# Altium project bme_affect.PrjPcb
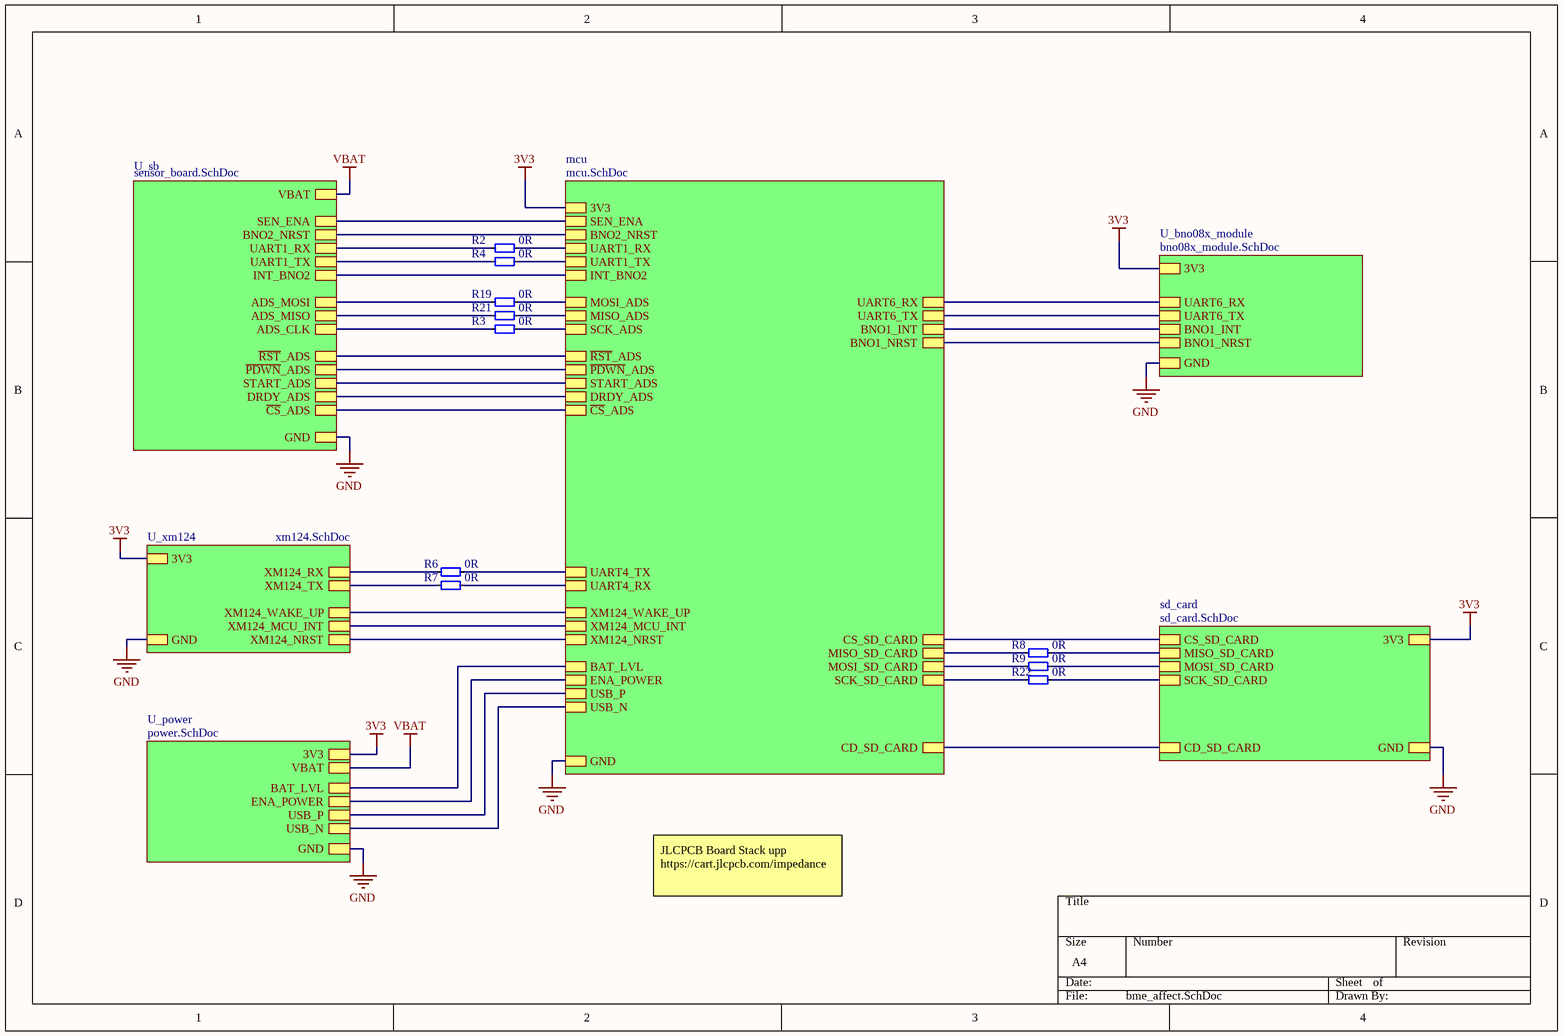
[diagram p0: bme_affect.SchDoc]
7 sheets, 138 parts. Net scope: strictly hierarchical (ports join the sheet entries above them; power ports are local).
Board file: bme_affect.PcbDoc
Sheets:
  bme_affect.SchDoc
    sd_card = sd_card.SchDoc
    mcu = mcu.SchDoc
    U_power = power.SchDoc
    U_xm124 = xm124.SchDoc
    U_sb = sensor_board.SchDoc
    U_bno08x_module = bno08x_module.SchDoc

## Sheet bme_affect.SchDoc
size A4; SheetNumber: 1; SheetTotal: 7

### Parts
R2  value 0R  [0402 res]  (hidden comment: 0603, resistor)
R3  value 0R  [0402 res]  (hidden comment: 0603, resistor)
R4  value 0R  [0402 res]  (hidden comment: 0603, resistor)
R6  value 0R  [0402 res]  (hidden comment: 0603, resistor)
R7  value 0R  [0402 res]  (hidden comment: 0603, resistor)
R8  value 0R  [0402 res]  (hidden comment: 0603, resistor)
R9  value 0R  [0402 res]  (hidden comment: 0603, resistor)
R19  value 0R  [0402 res]  (hidden comment: 0603, resistor)
R21  value 0R  [0402 res]  (hidden comment: 0603, resistor)
R22  value 0R  [0402 res]  (hidden comment: 0603, resistor)

### Sub-sheets
mcu = mcu.SchDoc: 3V3, GND, SCK_SD_CARD, MISO_SD_CARD, ~{CS}_ADS, MOSI_SD_CARD, CS_SD_CARD, ~{RST}_ADS, START_ADS, ~{PDWN}_ADS, CD_SD_CARD, USB_N, USB_P, MISO_ADS, DRDY_ADS, SCK_ADS, MOSI_ADS, UART6_RX, UART6_TX, INT_BNO2, UART1_RX, UART1_TX, BNO1_INT, BNO1_NRST, BNO2_NRST, XM124_NRST, XM124_MCU_INT, XM124_WAKE_UP, UART4_TX, UART4_RX, ENA_POWER, BAT_LVL, SEN_ENA
sd_card = sd_card.SchDoc: CS_SD_CARD, MISO_SD_CARD, MOSI_SD_CARD, SCK_SD_CARD, 3V3, GND, CD_SD_CARD
U_bno08x_module = bno08x_module.SchDoc: 3V3, GND, BNO1_INT, BNO1_NRST, UART6_RX, UART6_TX
U_power = power.SchDoc: GND, 3V3, VBAT, USB_N, USB_P, ENA_POWER, BAT_LVL
U_sb = sensor_board.SchDoc: ~{CS}_ADS, ADS_CLK, ADS_MISO, ADS_MOSI, DRDY_ADS, START_ADS, ~{RST}_ADS, ~{PDWN}_ADS, GND, VBAT, INT_BNO2, UART1_RX, UART1_TX, BNO2_NRST, SEN_ENA
U_xm124 = xm124.SchDoc: GND, 3V3, XM124_RX, XM124_TX, XM124_NRST, XM124_MCU_INT, XM124_WAKE_UP

### Nets
3V3: sheet sd_card/3V3, sheet mcu/3V3, sheet U_power/3V3, sheet U_xm124/3V3, sheet U_bno08x_module/3V3
GND: sheet sd_card/GND, sheet mcu/GND, sheet U_power/GND, sheet U_xm124/GND, sheet U_sb/GND, sheet U_bno08x_module/GND
VBAT: sheet U_power/VBAT, sheet U_sb/VBAT
BNO1_INT: sheet mcu/BNO1_INT, sheet U_bno08x_module/BNO1_INT
BNO1_NRST: sheet mcu/BNO1_NRST, sheet U_bno08x_module/BNO1_NRST
BNO2_NRST: sheet mcu/BNO2_NRST, sheet U_sb/BNO2_NRST
~{CS}_ADS: sheet mcu/~{CS}_ADS, sheet U_sb/~{CS}_ADS
CD_SD_CARD: sheet sd_card/CD_SD_CARD, sheet mcu/CD_SD_CARD
CS_SD_CARD: sheet sd_card/CS_SD_CARD, sheet mcu/CS_SD_CARD
DRDY_ADS: sheet mcu/DRDY_ADS, sheet U_sb/DRDY_ADS
INT_BNO2: sheet mcu/INT_BNO2, sheet U_sb/INT_BNO2
MISO_ADS: R21.0 ; sheet mcu/MISO_ADS
MISO_SD_CARD: R8.1 ; sheet mcu/MISO_SD_CARD
MOSI_ADS: R19.0 ; sheet mcu/MOSI_ADS
MOSI_SD_CARD: R9.1 ; sheet mcu/MOSI_SD_CARD
~{PDWN}_ADS: sheet mcu/~{PDWN}_ADS, sheet U_sb/~{PDWN}_ADS
~{RST}_ADS: sheet mcu/~{RST}_ADS, sheet U_sb/~{RST}_ADS
SCK_ADS: R3.0 ; sheet mcu/SCK_ADS
SCK_SD_CARD: R22.1 ; sheet mcu/SCK_SD_CARD
SEN_ENA: sheet mcu/SEN_ENA, sheet U_sb/SEN_ENA
START_ADS: sheet mcu/START_ADS, sheet U_sb/START_ADS
UART1_RX: R2.0 ; sheet mcu/UART1_RX
UART1_TX: R4.0 ; sheet mcu/UART1_TX
UART4_RX: R7.0 ; sheet mcu/UART4_RX
UART4_TX: R6.0 ; sheet mcu/UART4_TX
UART6_RX: sheet mcu/UART6_RX, sheet U_bno08x_module/UART6_RX
UART6_TX: sheet mcu/UART6_TX, sheet U_bno08x_module/UART6_TX
USB_N: sheet mcu/USB_N, sheet U_power/USB_N
USB_P: sheet mcu/USB_P, sheet U_power/USB_P
XM124_MCU_INT: sheet mcu/XM124_MCU_INT, sheet U_xm124/XM124_MCU_INT
XM124_NRST: sheet mcu/XM124_NRST, sheet U_xm124/XM124_NRST
XM124_WAKE_UP: sheet mcu/XM124_WAKE_UP, sheet U_xm124/XM124_WAKE_UP
NetD4_2: sheet mcu/ENA_POWER, sheet U_power/ENA_POWER
NetM1_2: R6.1 ; sheet U_xm124/XM124_RX
NetM1_3: R7.1 ; sheet U_xm124/XM124_TX
NetP1_3: R9.0 ; sheet sd_card/MOSI_SD_CARD
NetP1_5: R22.0 ; sheet sd_card/SCK_SD_CARD
NetP1_7: R8.0 ; sheet sd_card/MISO_SD_CARD
NetP2_4: R4.1 ; sheet U_sb/UART1_TX
NetP2_5: R2.1 ; sheet U_sb/UART1_RX
NetP2_7: R3.1 ; sheet U_sb/ADS_CLK
NetP2_8: R21.1 ; sheet U_sb/ADS_MISO
NetP2_9: R19.1 ; sheet U_sb/ADS_MOSI
NetR1_1: sheet mcu/BAT_LVL, sheet U_power/BAT_LVL

### Notes on the sheet
- JLCPCB Board Stack upp
  https://cart.jlcpcb.com/impedance

### Library data of the parts
R2-R4 R6-R9 R19 R21 R22 = 0603, resistor: Manufacturer Part No: RMCF0402ZT0R00

## Sheet sd_card.SchDoc
size A4; SheetNumber: 6; SheetTotal: 9
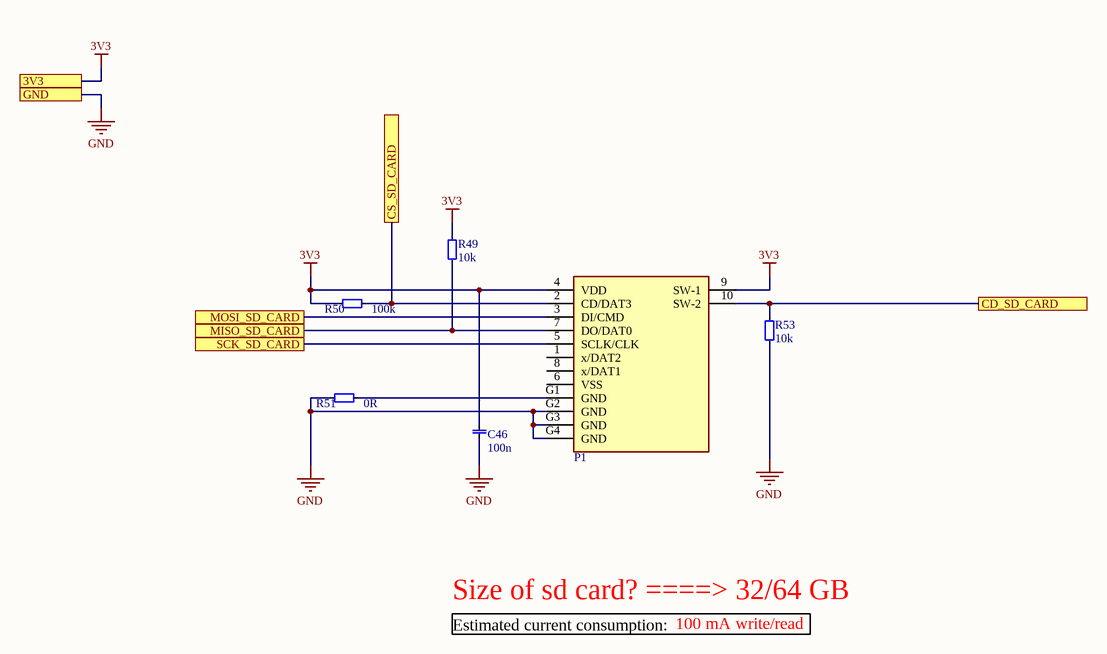
[diagram p1: sd_card.SchDoc]

### Parts
C46  value 100n  [0402 CAP]  (hidden comment: 0603, capacitor)
P1  SD Card connector  [MOLEX_104031-0811]  (value not drawn)
R49  value 10k  [0402 res]  (hidden comment: 0603, resistor)
R50  value 100k  [0402 res]  (hidden comment: 0603, resistor)
R51  value 0R  [0402 res]  (hidden comment: 0603, resistor)
R53  value 10k  [0402 res]  (hidden comment: 0603, resistor)

### Ports
3V3, CD_SD_CARD, CS_SD_CARD, GND, MISO_SD_CARD, MOSI_SD_CARD, SCK_SD_CARD

### Nets
3V3: C46.1 P1.4(VDD) P1.9(SW-1) R49.0 R50.0 ; port 3V3
GND: C46.0 P1.G2(GND) P1.G3(GND) P1.G4(GND) R51.0 R53.1 ; port GND
CD_SD_CARD: P1.10(SW-2) R53.0 ; port CD_SD_CARD
CS_SD_CARD: P1.2(CD/DAT3) R50.1 ; port CS_SD_CARD
NetP1_3: P1.3(DI/CMD) ; port MOSI_SD_CARD
NetP1_5: P1.5(SCLK/CLK) ; port SCK_SD_CARD
NetP1_7: P1.7(DO/DAT0) R49.1 ; port MISO_SD_CARD
NetP1_G1: P1.G1(GND) R51.1

Not connected (* = marked no-connect by the designer): P1 1(x/DAT2) 6(VSS) 8(x/DAT1)

### Notes on the sheet
- Size of sd card? ====> 32/64 GB
- Estimated current consumption:
- 100 mA write/read

### Library data of the parts
C46 = 0603, capacitor: Manufacturer Part No: GRM155R62A104KE14D; Order number: *
P1 = SD Card connector: SD Card connector - SD Card connector; Manufacturer Part No: 1040310811; Value: SD Card Connector
R49 R53 = 0603, resistor: Manufacturer Part No: 311-10.0KLRCT-ND
R50 = 0603, resistor: Manufacturer Part No: RC0402FR-07100KL
R51 = 0603, resistor: Manufacturer Part No: RMCF0402ZT0R00

## Sheet mcu.SchDoc
size A3; SheetNumber: 2; SheetTotal: 7
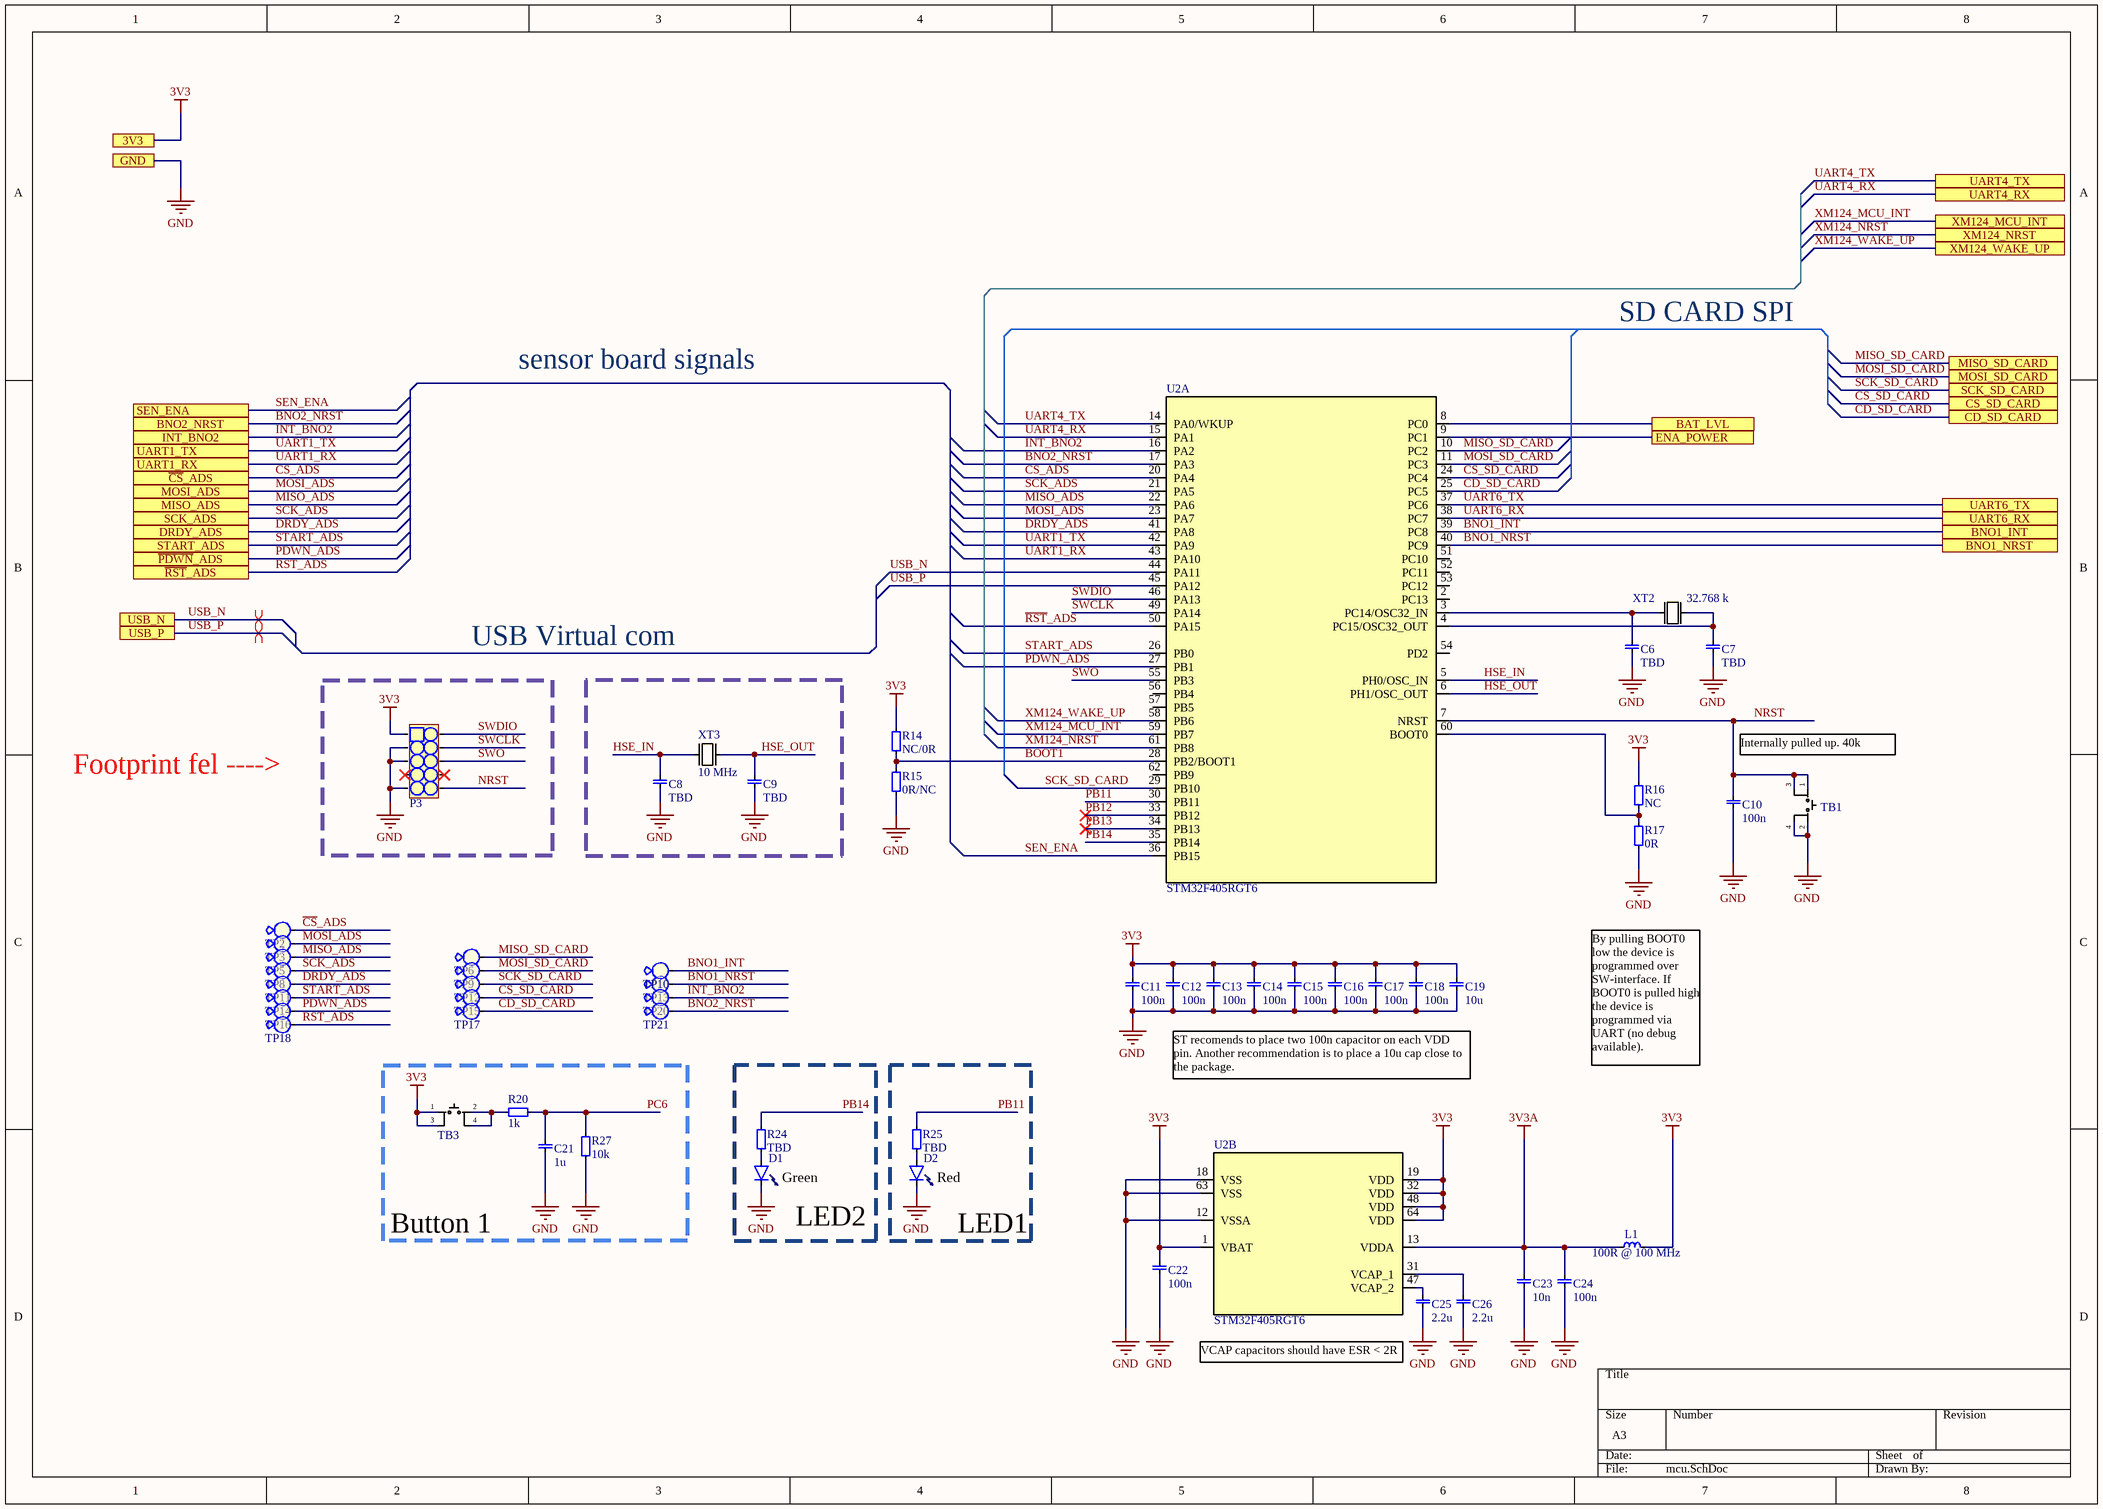
[diagram p2: mcu.SchDoc]

### Parts
C6  value TBD  [0603 cap]  (hidden comment: 0603, capacitor)
C7  value TBD  [0603 cap]  (hidden comment: 0603, capacitor)
C8  value TBD  [0603 cap]  (hidden comment: 0603, capacitor)
C9  value TBD  [0603 cap]  (hidden comment: 0603, capacitor)
C10  value 100n  [0402 CAP]  (hidden comment: 0603, capacitor)
C11  value 100n  [0402 CAP]  (hidden comment: 0603, capacitor)
C12  value 100n  [0402 CAP]  (hidden comment: 0603, capacitor)
C13  value 100n  [0402 CAP]  (hidden comment: 0603, capacitor)
C14  value 100n  [0402 CAP]  (hidden comment: 0603, capacitor)
C15  value 100n  [0402 CAP]  (hidden comment: 0603, capacitor)
C16  value 100n  [0402 CAP]  (hidden comment: 0603, capacitor)
C17  value 100n  [0402 CAP]  (hidden comment: 0603, capacitor)
C18  value 100n  [0402 CAP]  (hidden comment: 0603, capacitor)
C19  value 10u  [0402 CAP]  (hidden comment: 0603, capacitor)
C21  value 1u  [0402 CAP]  (hidden comment: 0603, capacitor)
C22  value 100n  [0402 CAP]  (hidden comment: 0603, capacitor)
C23  value 10n  [0402 CAP]  (hidden comment: 0603, capacitor)
C24  value 100n  [0402 CAP]  (hidden comment: 0603, capacitor)
C25  value 2.2u  [0402 CAP]  (hidden comment: 0603, capacitor)
C26  value 2.2u  [0402 CAP]  (hidden comment: 0603, capacitor)
D1  0603, LED  [0603 LED]  (value not drawn)
D2  0603, LED  [0603 LED]  (value not drawn)
L1  value 100R @ 100 MHz  [0805]  (hidden comment: 0805, Ferrite Bead)
P3  ARM 10 pin SWD  [FTSH-105-01-L-DV-K even odd]  (value not drawn)
R14  value NC/0R  [0402 res]  (hidden comment: 0603, resistor)
R15  value 0R/NC  [0402 res]  (hidden comment: 0603, resistor)
R16  value NC  [0402 res]  (hidden comment: 0603, resistor)
R17  value 0R  [0402 res]  (hidden comment: 0603, resistor)
R20  value 1k  [0402 res]  (hidden comment: 0603, resistor)
R24  value TBD  [0402 res]  (hidden comment: 0603, resistor)
R25  value TBD  [0402 res]  (hidden comment: 0603, resistor)
R27  value 10k  [0402 res]  (hidden comment: 0603, resistor)
TB1  Tactile Button  [tacButton smd]  (value not drawn)
TB3  Tactile Button  [tacButton smd]  (value not drawn)
TP2  Test Point  [testPoint]  (value not drawn)
TP3  Test Point  [testPoint]  (value not drawn)
TP5  Test Point  [testPoint]  (value not drawn)
TP6  Test Point  [testPoint]  (value not drawn)
TP8  Test Point  [testPoint]  (value not drawn)
TP9  Test Point  [testPoint]  (value not drawn)
TP10  Test Point  [testPoint]  (value not drawn)
TP11  Test Point  [testPoint]  (value not drawn)
TP12  Test Point  [testPoint]  (value not drawn)
TP13  Test Point  [testPoint]  (value not drawn)
TP14  Test Point  [testPoint]  (value not drawn)
TP15  Test Point  [testPoint]  (value not drawn)
TP16  Test Point  [testPoint]  (value not drawn)
TP17  Test Point  [testPoint]  (value not drawn)
TP18  Test Point  [testPoint]  (value not drawn)
TP20  Test Point  [testPoint]  (value not drawn)
TP21  Test Point  [testPoint]  (value not drawn)
U2  STM32F405RGT6  [LQFP64-10x10mm_s]  (parts A,B of 2)
XT2  value 32.768 k  [ECS-.327-12.5-39-TR]  (hidden comment: Crystal)
XT3  value 10 MHz  [XTAL_SMD_LP]  (hidden comment: XTAL TXC 7A)

### Blocks framed on the sheet
Button 1: C21 R20 R27 TB3
LED2: D1 R24
LED1: D2 R25

### Ports
3V3, BAT_LVL, BNO1_INT, BNO1_NRST, BNO2_NRST, CD_SD_CARD, CS_SD_CARD, DRDY_ADS, ENA_POWER, GND, INT_BNO2, MISO_ADS, MISO_SD_CARD, MOSI_ADS, MOSI_SD_CARD, SCK_ADS, SCK_SD_CARD, SEN_ENA, START_ADS, UART1_RX, UART1_TX, UART4_RX, UART4_TX, UART6_RX, UART6_TX, USB_N, USB_P, XM124_MCU_INT, XM124_NRST, XM124_WAKE_UP, ~{CS}_ADS, ~{PDWN}_ADS, ~{RST}_ADS

### Nets
3V3: C11.1 C12.1 C13.1 C14.1 C15.1 C16.1 C17.1 C18.1 C19.1 C22.1 L1.0 P3.1 R14.0 R16.0 TB3.1 TB3.3 U2.1(VBAT) U2.19(VDD) U2.32(VDD) U2.48(VDD) U2.64(VDD) ; port 3V3
3V3A: C23.1 C24.1 L1.1 U2.13(VDDA)
GND: C6.0 C7.0 C8.0 C9.0 C10.0 C11.0 C12.0 C13.0 C14.0 C15.0 C16.0 C17.0 C18.0 C19.0 C21.0 C22.0 C23.0 C24.0 C25.0 C26.0 D1.0(Cathode) D2.0(Cathode) P3.3 P3.5 P3.9 R15.1 R17.1 R27.0 TB1.2 TB1.4 U2.12(VSSA) U2.18(VSS) U2.63(VSS) ; port GND
BNO1_INT: TP10.0 U2.39(PC8) ; port BNO1_INT
BNO1_NRST: TP13.0 U2.40(PC9) ; port BNO1_NRST
BNO2_NRST: TP21.0 U2.17(PA3) ; port BNO2_NRST
BOOT1: R14.1 R15.0 U2.28(PB2/BOOT1)
~{CS}_ADS: TP2.0 U2.20(PA4) ; port ~{CS}_ADS
CD_SD_CARD: TP17.0 U2.25(PC5) ; port CD_SD_CARD
CS_SD_CARD: TP15.0 U2.24(PC4) ; port CS_SD_CARD
DRDY_ADS: TP11.0 U2.41(PA8) ; port DRDY_ADS
HSE_IN: C8.1 U2.5(PH0/OSC_IN) XT3.1
HSE_OUT: C9.1 U2.6(PH1/OSC_OUT) XT3.2
INT_BNO2: TP20.0 U2.16(PA2) ; port INT_BNO2
MISO_ADS: TP5.0 U2.22(PA6) ; port MISO_ADS
MISO_SD_CARD: TP6.0 U2.10(PC2) ; port MISO_SD_CARD
MOSI_ADS: TP3.0 U2.23(PA7) ; port MOSI_ADS
MOSI_SD_CARD: TP9.0 U2.11(PC3) ; port MOSI_SD_CARD
NRST: C10.1 P3.10 TB1.1 TB1.3 U2.7(NRST)
~{PDWN}_ADS: TP16.0 U2.27(PB1) ; port ~{PDWN}_ADS
PB11: R25.1 U2.30(PB11)
PB12: U2.33(PB12)
PB13: U2.34(PB13)
PB14: R24.1 U2.35(PB14)
PC6: C21.1 R20.1 R27.1
~{RST}_ADS: TP18.0 U2.50(PA15) ; port ~{RST}_ADS
SCK_ADS: TP8.0 U2.21(PA5) ; port SCK_ADS
SCK_SD_CARD: TP12.0 U2.29(PB10) ; port SCK_SD_CARD
SEN_ENA: U2.36(PB15) ; port SEN_ENA
START_ADS: TP14.0 U2.26(PB0) ; port START_ADS
SWCLK: P3.4 U2.49(PA14)
SWDIO: P3.2 U2.46(PA13)
SWO: P3.6 U2.55(PB3)
UART1_RX: U2.43(PA10) ; port UART1_RX
UART1_TX: U2.42(PA9) ; port UART1_TX
UART4_RX: U2.15(PA1) ; port UART4_RX
UART4_TX: U2.14(PA0/WKUP) ; port UART4_TX
UART6_RX: U2.38(PC7) ; port UART6_RX
UART6_TX: U2.37(PC6) ; port UART6_TX
USB_N: U2.44(PA11) ; port USB_N
USB_P: U2.45(PA12) ; port USB_P
XM124_MCU_INT: U2.59(PB7) ; port XM124_MCU_INT
XM124_NRST: U2.61(PB8) ; port XM124_NRST
XM124_WAKE_UP: U2.58(PB6) ; port XM124_WAKE_UP
NetC6_1: C6.1 U2.3(PC14/OSC32_IN) XT2.1
NetC7_1: C7.1 U2.4(PC15/OSC32_OUT) XT2.2
NetC25_1: C25.1 U2.47(VCAP_2)
NetC26_1: C26.1 U2.31(VCAP_1)
NetD1_1: D1.1 R24.0
NetD2_1: D2.1 R25.0
NetD4_2: U2.9(PC1) ; port ENA_POWER
NetR1_1: U2.8(PC0) ; port BAT_LVL
NetR16_1: R16.1 R17.0 U2.60(BOOT0)
NetR20_0: R20.0 TB3.2 TB3.4

Not connected (* = marked no-connect by the designer): P3 7* 8*; U2 2(PC13) 51(PC10) 52(PC11) 53(PC12) 54(PD2) 56(PB4) 57(PB5) 62(PB9)

### Layout directives
differential pair: USB_N, USB_P

### Notes on the sheet
- sensor board signals
- SD CARD SPI
- USB Virtual com
- Footprint fel ---->
- Internally pulled up. 40k
- ST recomends to place two 100n capacitor on each VDD pin. Another recommendation is to place a 10u cap close to the package.
- By pulling BOOT0 low the device is programmed over SW-interface. If BOOT0 is pulled high the device is programmed via UART (no debug available).
- Green
- Red
- VCAP capacitors should have ESR < 2R

### Library data of the parts
C10-C18 C22 C24 = 0603, capacitor: Manufacturer Part No: GRM155R62A104KE14D; Order number: *
C19 = 0603, capacitor: Manufacturer Part No: GRM155R61A106ME11D; Order number: *
C21 = 0603, capacitor: Manufacturer Part No: C0402C105K9PAC7867; Order number: *
C23 = 0603, capacitor: Manufacturer Part No: CC0402KRX7R0BB103; Order number: *
C25 C26 = 0603, capacitor: Manufacturer Part No: GRM155D71A225ME15D; Order number: *
D1 = 0603, LED: Manufacturer Part No: 5988081107F
D2 = 0603, LED: Manufacturer Part No: 150060SS75003
L1 = 0805, Ferrite Bead: Manufacturer Part No: 74279207; Order number: 732-4624-1-ND; Supplier: Digikey
P3 = ARM 10 pin SWD: 1.27mm, PH; Manufacturer Part No: FTSH-105-01-L-DV-K; Value: 2x5 Pin Header, 2.54mm, Th; Digikey: FTSH-105-01-L-DV-K
R14 R15 R17 = 0603, resistor: Manufacturer Part No: RMCF0402ZT0R00
R20 = 0603, resistor: Manufacturer Part No: RC0402FR-071KL
R27 = 0603, resistor: Manufacturer Part No: 311-10.0KLRCT-ND
TB1 TB3 = TacButton SMD: Tactile Switch Small Low; Manufacturer Part No: 430182043816; ELFA: 110-87-406; Value: Button SMD
U2 = STM32F405RGT6: No Description Available; Vendor: STMicroelectronics; Built_By: EMA_UL_Team; SourceLibrary: Updates_to_database_2020-10-19; Manufacturer Part Number: STM32F405RGT6; Copyright: Copyright (C) 2018 Accelerated Designs. All rights reserved; RefDes: RefDes; Type: DEV; Manufacturer Part No: STM32F405RGT6
XT2 = Crystal: Manufacturer Part No: CC4V-T1A-32.768KHZ-9PF-20PPM-TA-QC; Order number: 2195-CC4V-T1A-32.768KHZ-9PF-20PPM-TA-QCCT-ND; Supplier: Digikey
XT3 = XTAL TXC 7A: 16 MHz, SMD, 5mm x 3,2mm, 30 ppm; Manufacturer Part No: 7A-10.000MAAJ-T; Order number: 1841939; Supplier: Farnell
C6-C9 = 0603, capacitor: Order number: *
TP2 TP3 TP5 TP6 TP8-TP18 TP20 TP21 = Test Point: Value: Test point; Farnell: 1702006

## Sheet power.SchDoc
size A4; SheetNumber: 3; SheetTotal: 7
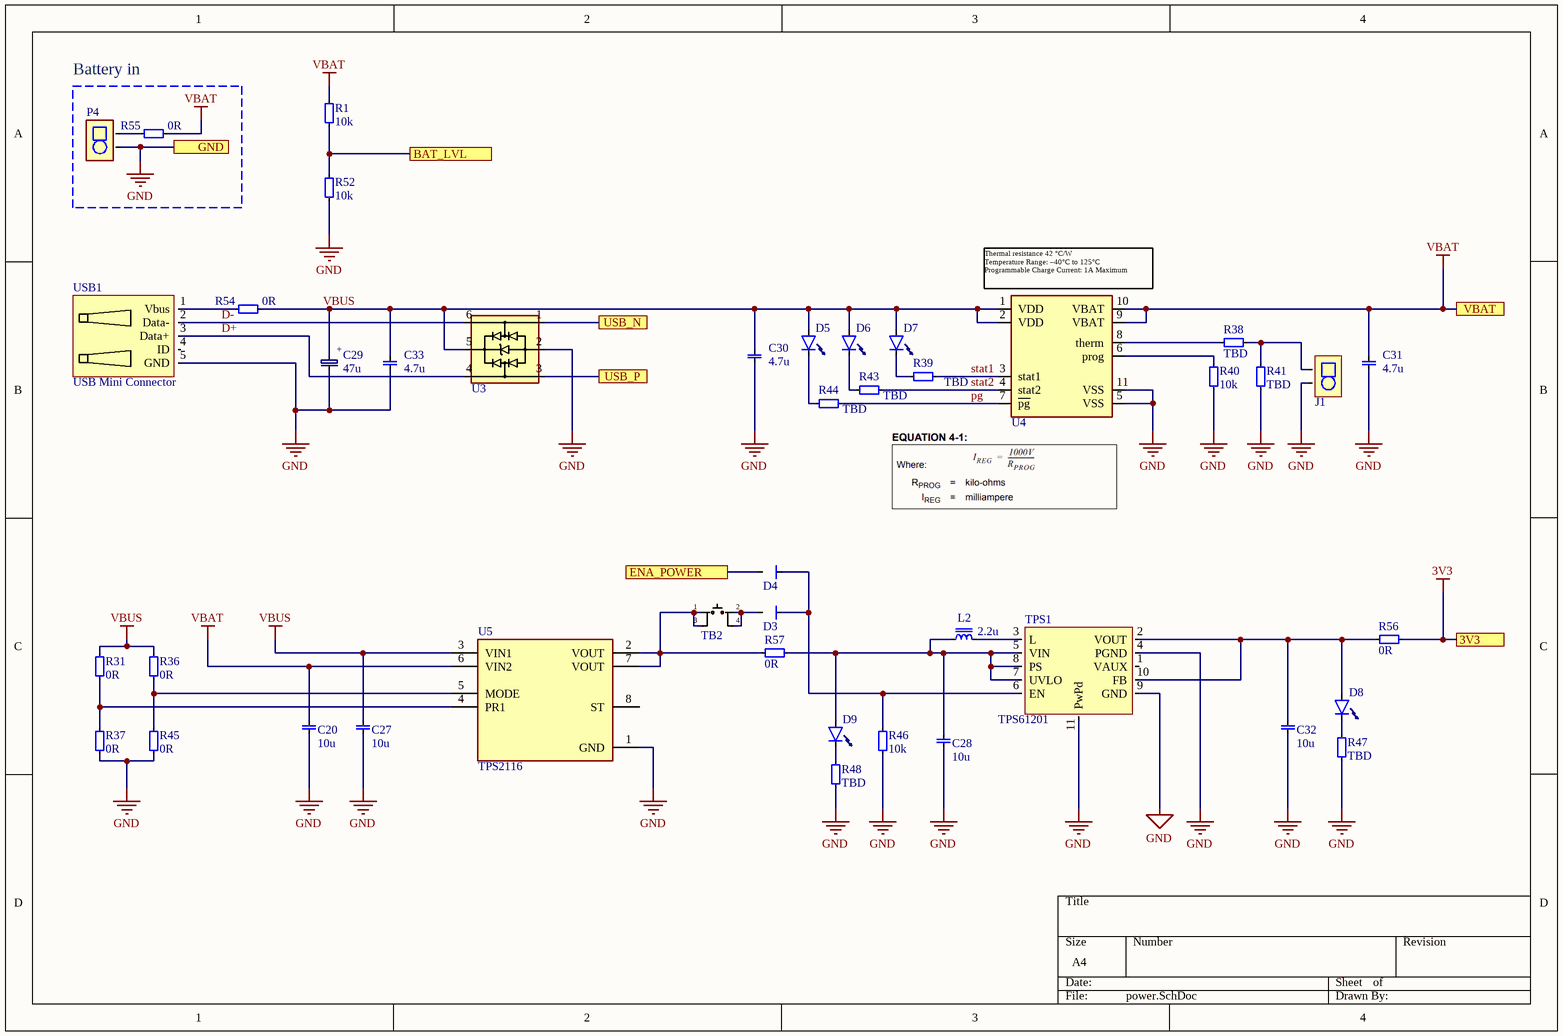
[diagram p3: power.SchDoc]

### Parts
C20  value 10u  [0402 CAP]  (hidden comment: 0402 capacitor)
C27  value 10u  [0402 CAP]  (hidden comment: 0402 capacitor)
C28  value 10u  [0402 CAP]  (hidden comment: 0402 capacitor)
C29  value 47u  [CASE_B]  (hidden comment: Cap, case B)
C30  value 4.7u  [0603 cap]  (hidden comment: 0603, capacitor)
C31  value 4.7u  [0603 cap]  (hidden comment: 0603, capacitor)
C32  value 10u  [0402 CAP]  (hidden comment: 0402 capacitor)
C33  value 4.7u  [0603 cap]  (hidden comment: 0603, capacitor)
D3  Diode, SMD  [SOD323]  (value not drawn)
D4  Diode, SMD  [SOD323]  (value not drawn)
D5  0603, LED  [0603 LED]  (value not drawn)
D6  0603, LED  [0603 LED]  (value not drawn)
D7  0603, LED  [0603 LED]  (value not drawn)
D8  0603, LED  [0603 LED]  (value not drawn)
D9  0603, LED  [0603 LED]  (value not drawn)
J1  Molex 0530480210  [MOLEX_0530480210]  (value not drawn)
L2  value 2.2u  [SRR4028]  (hidden comment: Coil, SRR4028)
P4  JST Connector  [JST_S2B-PH-K-S(LF)(SN)]  (value not drawn)
R1  value 10k  [0402 res]  (hidden comment: 0603, resistor)
R31  value 0R  [0402 res]  (hidden comment: 0603, resistor)
R36  value 0R  [0402 res]  (hidden comment: 0603, resistor)
R37  value 0R  [0402 res]  (hidden comment: 0603, resistor)
R38  value TBD  [0402 res]  (hidden comment: 0603, resistor)
R39  value TBD  [0402 res]  (hidden comment: 0603, resistor)
R40  value 10k  [0402 res]  (hidden comment: 0603, resistor)
R41  value TBD  [0402 res]  (hidden comment: 0603, resistor)
R43  value TBD  [0402 res]  (hidden comment: 0603, resistor)
R44  value TBD  [0402 res]  (hidden comment: 0603, resistor)
R45  value 0R  [0402 res]  (hidden comment: 0603, resistor)
R46  value 10k  [0402 res]  (hidden comment: 0603, resistor)
R47  value TBD  [0402 res]  (hidden comment: 0603, resistor)
R48  value TBD  [0402 res]  (hidden comment: 0603, resistor)
R52  value 10k  [0402 res]  (hidden comment: 0603, resistor)
R54  value 0R  [0603]  (hidden comment: 0603, resistor)
R55  value 0R  [0603]  (hidden comment: 0603, resistor)
R56  value 0R  [0603]  (hidden comment: 0603, resistor)
R57  value 0R  [0603]  (hidden comment: 0603, resistor)
TB2  Tactile Button  [tacButton smd]  (value not drawn)
TPS1  TPS61201  [PSON10N]
U3  USBLC6-2  [SOT236]  (value not drawn)
U4  MCP73833/4  [DFN10]  (value not drawn)
U5  TPS2116  [SOTFL50P160X60-8N]
USB1  USB Mini Connector  [USB Mini TH]

### Blocks framed on the sheet
Battery in: P4 R55

### Ports
3V3, BAT_LVL, ENA_POWER, GND, USB_N, USB_P, VBAT

### Nets
3V3: R56.0 ; port 3V3
GND: C20.0 C27.0 C28.0 C29.1 C30.0 C31.0 C32.0 C33.0 J1.2 P4.2 R37.0 R40.0 R41.0 R45.0 R46.0 R47.1 R48.1 R52.1 TPS1.4(PGND) TPS1.9(GND) TPS1.11(PwPd) U3.2 U4.5(VSS) U4.11(VSS) U5.1(GND) USB1.5(GND) ; port GND
VBAT: C20.1 C31.1 R1.0 R55.0 U4.9(VBAT) U4.10(VBAT) U5.6(VIN2) ; port VBAT
VBUS: C27.1 C29.2 C30.1 C33.1 D5.1 D6.1 D7.1 R31.1 R36.1 R54.0 U3.5 U4.1(VDD) U4.2(VDD) U5.3(VIN1)
D+: U3.4 USB1.3(Data+)
D-: U3.6 USB1.2(Data-)
~{pg}: R44.1 U4.7(~{pg})
stat1: R39.1 U4.3(stat1)
stat2: R43.1 U4.4(stat2)
USB_N: U3.1 ; port USB_N
USB_P: U3.3 ; port USB_P
NetC28_1: C28.1 D9.1 L2.2 R57.0 TPS1.5(VIN) TPS1.7(UVLO) TPS1.8(PS)
NetC32_1: C32.1 D8.1 R56.1 TPS1.2(VOUT) TPS1.10(FB)
NetD3_1: D3.1 D4.1 R46.1 TPS1.6(EN)
NetD3_2: D3.2 TB2.2 TB2.4
NetD4_2: D4.2 ; port ENA_POWER
NetD5_0: D5.0(Cathode) R44.0
NetD6_0: D6.0(Cathode) R43.0
NetD7_0: D7.0(Cathode) R39.0
NetD8_0: D8.0(Cathode) R47.0
NetD9_0: D9.0(Cathode) R48.0
NetJ1_1: J1.1 R38.0 R41.1
NetL2_1: L2.1 TPS1.3(L)
NetP4_1: P4.1 R55.1
NetR1_1: R1.1 R52.0 ; port BAT_LVL
NetR31_0: R31.0 R37.1 U5.4(PR1)
NetR36_0: R36.0 R45.1 U5.5(MODE)
NetR38_1: R38.1 U4.8(therm)
NetR40_1: R40.1 U4.6(prog)
NetR54_1: R54.1 USB1.1(Vbus)
NetR57_1: R57.1 TB2.1 TB2.3 U5.2(VOUT) U5.7(VOUT)

Not connected (* = marked no-connect by the designer): TPS1 1(VAUX); U5 8(ST); USB1 4(ID)

### Notes on the sheet
- (near U4) Thermal resistance 42 °C/W
  Temperature Range: –40°C to 125°C
  Programmable Charge Current: 1A Maximum
- (in symbol Cap, case B) +

### Library data of the parts
C20 C27 C28 C32 = 0402 capacitor: Manufacturer Part No: GRM155R61A106ME11D
C29 = Cap, case B: Manufacturer Part No: TAJB476M010RNJ
C30 C31 C33 = 0603, capacitor: Manufacturer Part No: GRM188C81C475KE11D; Order number: *
D3 D4 = Diode, SMD: Manufacturer Part No: CUS05S30H3FCT-ND
D5 D8 D9 = 0603, LED: Manufacturer Part No: 5988081107F
D6 D7 = 0603, LED: Manufacturer Part No: 150060SS75003
J1 = Molex 0530480210: PicoBlade Header R/A, 1.25 mm,; Manufacturer Part No: 0530480210
L2 = Coil, SRR4028: 2,2µH, 2.0 A, 28 mOhm; Manufacturer Part No: SRR4028-2R2Y; Digikey: SRR4028-2R2YCT-ND
P4 = JST Connector: Connector Header Through Hole, Right Angle 2 position; Manufacturer Part No: S2B-PH-K-S
R1 R52 = 0603, resistor: 311-10.0KLRCT-ND; Manufacturer Part No: 311-10.0KLRCT-ND
R31 R36 R37 R45 = 0603, resistor: Manufacturer Part No: RMCF0402ZT0R00
R40 R46 = 0603, resistor: Manufacturer Part No: 311-10.0KLRCT-ND
R54-R57 = 0603, resistor: Manufacturer Part No: 541-0.0GCT-ND
TB2 = TacButton SMD: as TB1 on sheet mcu; Value: Button SMD
TPS1 = TPS6120x: TPS6120x Low Input Voltage Synchronous Boost Converter; Manufacturer Part No: TPS61201DRCR; Value: TPS61200; DigiKey: 296-27017-1-ND
U3 = USBLC6-2: Very low capacitance 2 data-line and VBUS ESD protection; Manufacturer Part No: USBLC6-2SC6; Order number: 497-5235-1-ND; Value: Anti_esd; Supplier: Digikey
U4 = MCP73833/4: Stand-Alone Linear Li-Ion / Li-Polymer Charge / Management Controller; Manufacturer Part No: MCP73833-NVI/MF; Supplier: *; Order number: *
U5 = TPS2116: 1.6 V to 5.5 V, 2.5-A Low IQ Power Mux with Manual and Priority Switchover; Manufacturer Part No: TPS2116DRLR
USB1 = USB Mini Connector: Manufacturer Part No: XM7D-0512; Value: USB Mini Connector; Farnell: 1125348

## Sheet xm124.SchDoc
size A4; SheetNumber: 5; SheetTotal: 7
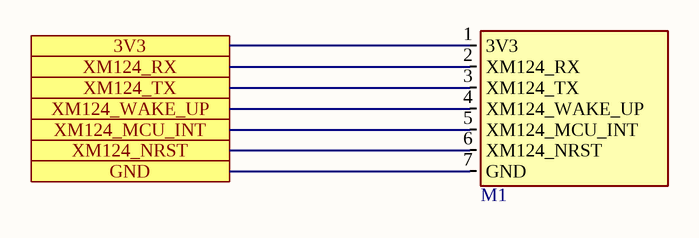
[diagram p4: xm124.SchDoc]

### Parts
M1  BME radar module  [BME_RADAR_MODULE]  (value not drawn)

### Ports
3V3, GND, XM124_MCU_INT, XM124_NRST, XM124_RX, XM124_TX, XM124_WAKE_UP

### Nets
3V3: M1.1(3V3) ; port 3V3
GND: M1.7(GND) ; port GND
XM124_MCU_INT: M1.5(XM124_MCU_INT) ; port XM124_MCU_INT
XM124_NRST: M1.6(XM124_NRST) ; port XM124_NRST
XM124_WAKE_UP: M1.4(XM124_WAKE_UP) ; port XM124_WAKE_UP
NetM1_2: M1.2(XM124_RX) ; port XM124_RX
NetM1_3: M1.3(XM124_TX) ; port XM124_TX

### Library data of the parts
M1 = BME radar module: XM124  Radar module; Manufacturer Part No: RSM-107-02-L-S; Value: 1x8 Pin Header

## Sheet sensor_board.SchDoc
size A4; SheetNumber: 6; SheetTotal: 7
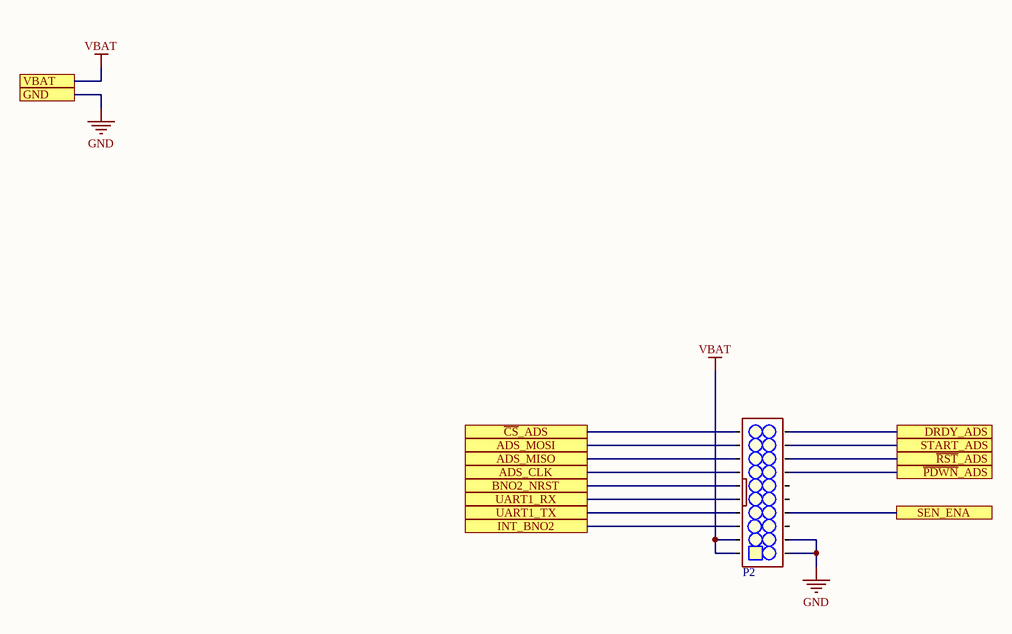
[diagram p5: sensor_board.SchDoc]

### Parts
P2  2x10 Ribbon Header  [2x10_RIBBON_CABLE_CON]  (value not drawn)

### Ports
ADS_CLK, ADS_MISO, ADS_MOSI, BNO2_NRST, DRDY_ADS, GND, INT_BNO2, SEN_ENA, START_ADS, UART1_RX, UART1_TX, VBAT, ~{CS}_ADS, ~{PDWN}_ADS, ~{RST}_ADS

### Nets
GND: P2.19 P2.20 ; port GND
VBAT: P2.1 P2.2 ; port VBAT
BNO2_NRST: P2.6 ; port BNO2_NRST
~{CS}_ADS: P2.10 ; port ~{CS}_ADS
DRDY_ADS: P2.11 ; port DRDY_ADS
INT_BNO2: P2.3 ; port INT_BNO2
~{PDWN}_ADS: P2.14 ; port ~{PDWN}_ADS
~{RST}_ADS: P2.13 ; port ~{RST}_ADS
SEN_ENA: P2.17 ; port SEN_ENA
START_ADS: P2.12 ; port START_ADS
NetP2_4: P2.4 ; port UART1_TX
NetP2_5: P2.5 ; port UART1_RX
NetP2_7: P2.7 ; port ADS_CLK
NetP2_8: P2.8 ; port ADS_MISO
NetP2_9: P2.9 ; port ADS_MOSI

Not connected (* = marked no-connect by the designer): P2 15 16 18

### Library data of the parts
P2 = 2x10 Ribbon Header: 2.54 mm; Manufacturer Part No: 302-S201; Value: 2x10 Pin Header

## Sheet bno08x_module.SchDoc
size A4; SheetNumber: 7; SheetTotal: 7
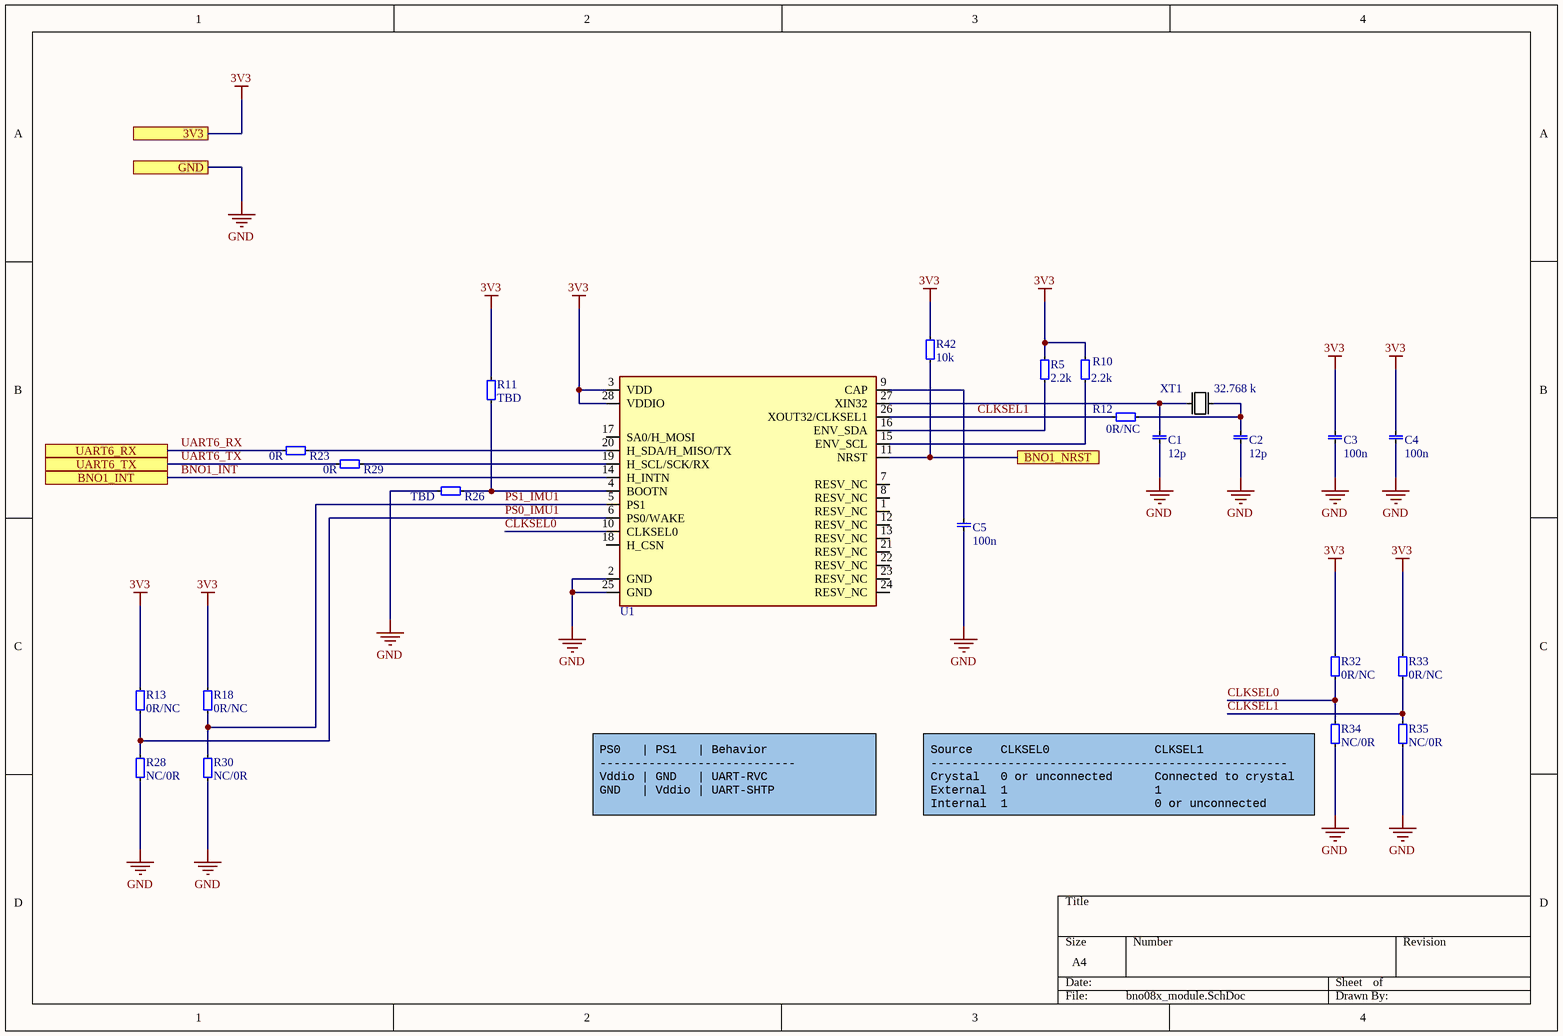
[diagram p6: bno08x_module.SchDoc]

### Parts
C1  value 12p  [0402 CAP]  (hidden comment: 0402 capacitor)
C2  value 12p  [0402 CAP]  (hidden comment: 0402 capacitor)
C3  value 100n  [0402 CAP]  (hidden comment: 0402 capacitor)
C4  value 100n  [0402 CAP]  (hidden comment: 0402 capacitor)
C5  value 100n  [0402 CAP]  (hidden comment: 0402 capacitor)
R5  value 2.2k  [0402 res]  (hidden comment: 0402, resistor)
R10  value 2.2k  [0402 res]  (hidden comment: 0402, resistor)
R11  value TBD  [0402 res]  (hidden comment: 0402, resistor)
R12  value 0R/NC  [0402 res]  (hidden comment: 0402, resistor)
R13  value 0R/NC  [0402 res]  (hidden comment: 0402, resistor)
R18  value 0R/NC  [0402 res]  (hidden comment: 0402, resistor)
R23  value 0R  [0402 res]  (hidden comment: 0402, resistor)
R26  value TBD  [0402 res]  (hidden comment: 0402, resistor)
R28  value NC/0R  [0402 res]  (hidden comment: 0402, resistor)
R29  value 0R  [0402 res]  (hidden comment: 0402, resistor)
R30  value NC/0R  [0402 res]  (hidden comment: 0402, resistor)
R32  value 0R/NC  [0402 res]  (hidden comment: 0402, resistor)
R33  value 0R/NC  [0402 res]  (hidden comment: 0402, resistor)
R34  value NC/0R  [0402 res]  (hidden comment: 0402, resistor)
R35  value NC/0R  [0402 res]  (hidden comment: 0402, resistor)
R42  value 10k  [0402 res]  (hidden comment: 0402, resistor)
U1  BNO08X  [LGA-28_2]  (value not drawn)
XT1  value 32.768 k  [ECS-.327-12.5-39-TR]  (hidden comment: Crystal)

### Ports
3V3, BNO1_INT, BNO1_NRST, GND, UART6_RX, UART6_TX

### Nets
3V3: C3.1 C4.1 R5.1 R10.1 R11.1 R13.0 R18.0 R32.0 R33.0 R42.1 U1.3(VDD) U1.28(VDDIO) ; port 3V3
GND: C1.0 C2.0 C3.0 C4.0 C5.0 R26.1 R28.1 R30.1 R34.1 R35.1 U1.2(GND) U1.25(GND) ; port GND
BNO1_INT: U1.14(H_INTN) ; port BNO1_INT
BNO1_NRST: R42.0 U1.11(NRST) ; port BNO1_NRST
CLKSEL0: R32.1 R34.0 U1.10(CLKSEL0)
CLKSEL1: R12.0 R33.1 R35.0 U1.26(XOUT32/CLKSEL1)
PS0_IMU1: R13.1 R28.0 U1.6(PS0/WAKE)
PS1_IMU1: R18.1 R30.0 U1.5(PS1)
UART6_RX: R23.1 ; port UART6_RX
UART6_TX: R29.1 ; port UART6_TX
NetC1_1: C1.1 U1.27(XIN32) XT1.1
NetC2_1: C2.1 R12.1 XT1.2
NetC5_1: C5.1 U1.9(CAP)
NetR5_0: R5.0 U1.16(ENV_SDA)
NetR10_0: R10.0 U1.15(ENV_SCL)
NetR11_0: R11.0 R26.0 U1.4(BOOTN)
NetR23_0: R23.0 U1.20(H_SDA/H_MISO/TX)
NetR29_0: R29.0 U1.19(H_SCL/SCK/RX)

Not connected (* = marked no-connect by the designer): U1 1(RESV_NC) 7(RESV_NC) 8(RESV_NC) 12(RESV_NC) 13(RESV_NC) 17(SA0/H_MOSI) 18(H_CSN) 21(RESV_NC) 22(RESV_NC) 23(RESV_NC) 24(RESV_NC)

### Notes on the sheet
- PS0   | PS1   | Behavior
  ----------------------------
  Vddio | GND   | UART-RVC
  GND   | Vddio | UART-SHTP
- (near R34) Source    CLKSEL0               CLKSEL1
  ---------------------------------------------------
  Crystal   0 or unconnected      Connected to crystal
  External  1                     1
  Internal  1                     0 or unconnected

### Library data of the parts
C1 C2 = 0402 capacitor: Manufacturer Part No: GJM1555C1H120JB01D
C3-C5 = 0402 capacitor: Manufacturer Part No: GRM155R62A104KE14D
R5 R10 = 0402, resistor: Manufacturer Part No: RC0402FR-072K2L
R12 R13 R18 R23 R28-R30 R32-R35 = 0402, resistor: Manufacturer Part No: RMCF0402ZT0R00
R42 = 0402, resistor: Manufacturer Part No: 311-10.0KLRCT-ND
U1 = BNO08X: 9-axis IMU; Manufacturer Part No: BNO085
XT1 = Crystal: Manufacturer Part No: CC4V-T1A-32.768KHZ-9PF-20PPM-TA-QC

## Nets that join several sheets
3V3: sd_card (5 pins), mcu (21 pins), power (R56.0), xm124 (M1.1), bno08x_module (12 pins)
GND: sd_card (6 pins), mcu (33 pins), power (26 pins), xm124 (M1.7), sensor_board (P2.19 P2.20), bno08x_module (12 pins)
VBAT: power (7 pins), sensor_board (P2.1 P2.2)
BNO1_INT: mcu (TP10.0 U2.39), bno08x_module (U1.14)
BNO1_NRST: mcu (TP13.0 U2.40), bno08x_module (R42.0 U1.11)
BNO2_NRST: mcu (TP21.0 U2.17), sensor_board (P2.6)
~{CS}_ADS: mcu (TP2.0 U2.20), sensor_board (P2.10)
CD_SD_CARD: sd_card (P1.10 R53.0), mcu (TP17.0 U2.25)
CS_SD_CARD: sd_card (P1.2 R50.1), mcu (TP15.0 U2.24)
DRDY_ADS: mcu (TP11.0 U2.41), sensor_board (P2.11)
INT_BNO2: mcu (TP20.0 U2.16), sensor_board (P2.3)
MISO_ADS: bme_affect (R21.0), mcu (TP5.0 U2.22)
MISO_SD_CARD: bme_affect (R8.1), mcu (TP6.0 U2.10)
MOSI_ADS: bme_affect (R19.0), mcu (TP3.0 U2.23)
MOSI_SD_CARD: bme_affect (R9.1), mcu (TP9.0 U2.11)
NetD4_2: mcu (U2.9), power (D4.2)
NetM1_2: bme_affect (R6.1), xm124 (M1.2)
NetM1_3: bme_affect (R7.1), xm124 (M1.3)
NetP1_3: bme_affect (R9.0), sd_card (P1.3)
NetP1_5: bme_affect (R22.0), sd_card (P1.5)
NetP1_7: bme_affect (R8.0), sd_card (P1.7 R49.1)
NetP2_4: bme_affect (R4.1), sensor_board (P2.4)
NetP2_5: bme_affect (R2.1), sensor_board (P2.5)
NetP2_7: bme_affect (R3.1), sensor_board (P2.7)
NetP2_8: bme_affect (R21.1), sensor_board (P2.8)
NetP2_9: bme_affect (R19.1), sensor_board (P2.9)
NetR1_1: mcu (U2.8), power (R1.1 R52.0)
~{PDWN}_ADS: mcu (TP16.0 U2.27), sensor_board (P2.14)
~{RST}_ADS: mcu (TP18.0 U2.50), sensor_board (P2.13)
SCK_ADS: bme_affect (R3.0), mcu (TP8.0 U2.21)
SCK_SD_CARD: bme_affect (R22.1), mcu (TP12.0 U2.29)
SEN_ENA: mcu (U2.36), sensor_board (P2.17)
START_ADS: mcu (TP14.0 U2.26), sensor_board (P2.12)
UART1_RX: bme_affect (R2.0), mcu (U2.43)
UART1_TX: bme_affect (R4.0), mcu (U2.42)
UART4_RX: bme_affect (R7.0), mcu (U2.15)
UART4_TX: bme_affect (R6.0), mcu (U2.14)
UART6_RX: mcu (U2.38), bno08x_module (R23.1)
UART6_TX: mcu (U2.37), bno08x_module (R29.1)
USB_N: mcu (U2.44), power (U3.1)
USB_P: mcu (U2.45), power (U3.3)
XM124_MCU_INT: mcu (U2.59), xm124 (M1.5)
XM124_NRST: mcu (U2.61), xm124 (M1.6)
XM124_WAKE_UP: mcu (U2.58), xm124 (M1.4)